# Altium schematic sheet Analog - Low Speed SE.SchDoc: Analog - Low Speed Single-Ended
size B; DrawnBy: Jasper Yun; SheetNumber: 11; SheetTotal: 13; Competition: SAC 2021; Subteam: Avionics; University: McGill University; Location: Montreal, Quebec; Project: Avionics Project Name; MRT: McGill Rocket Team
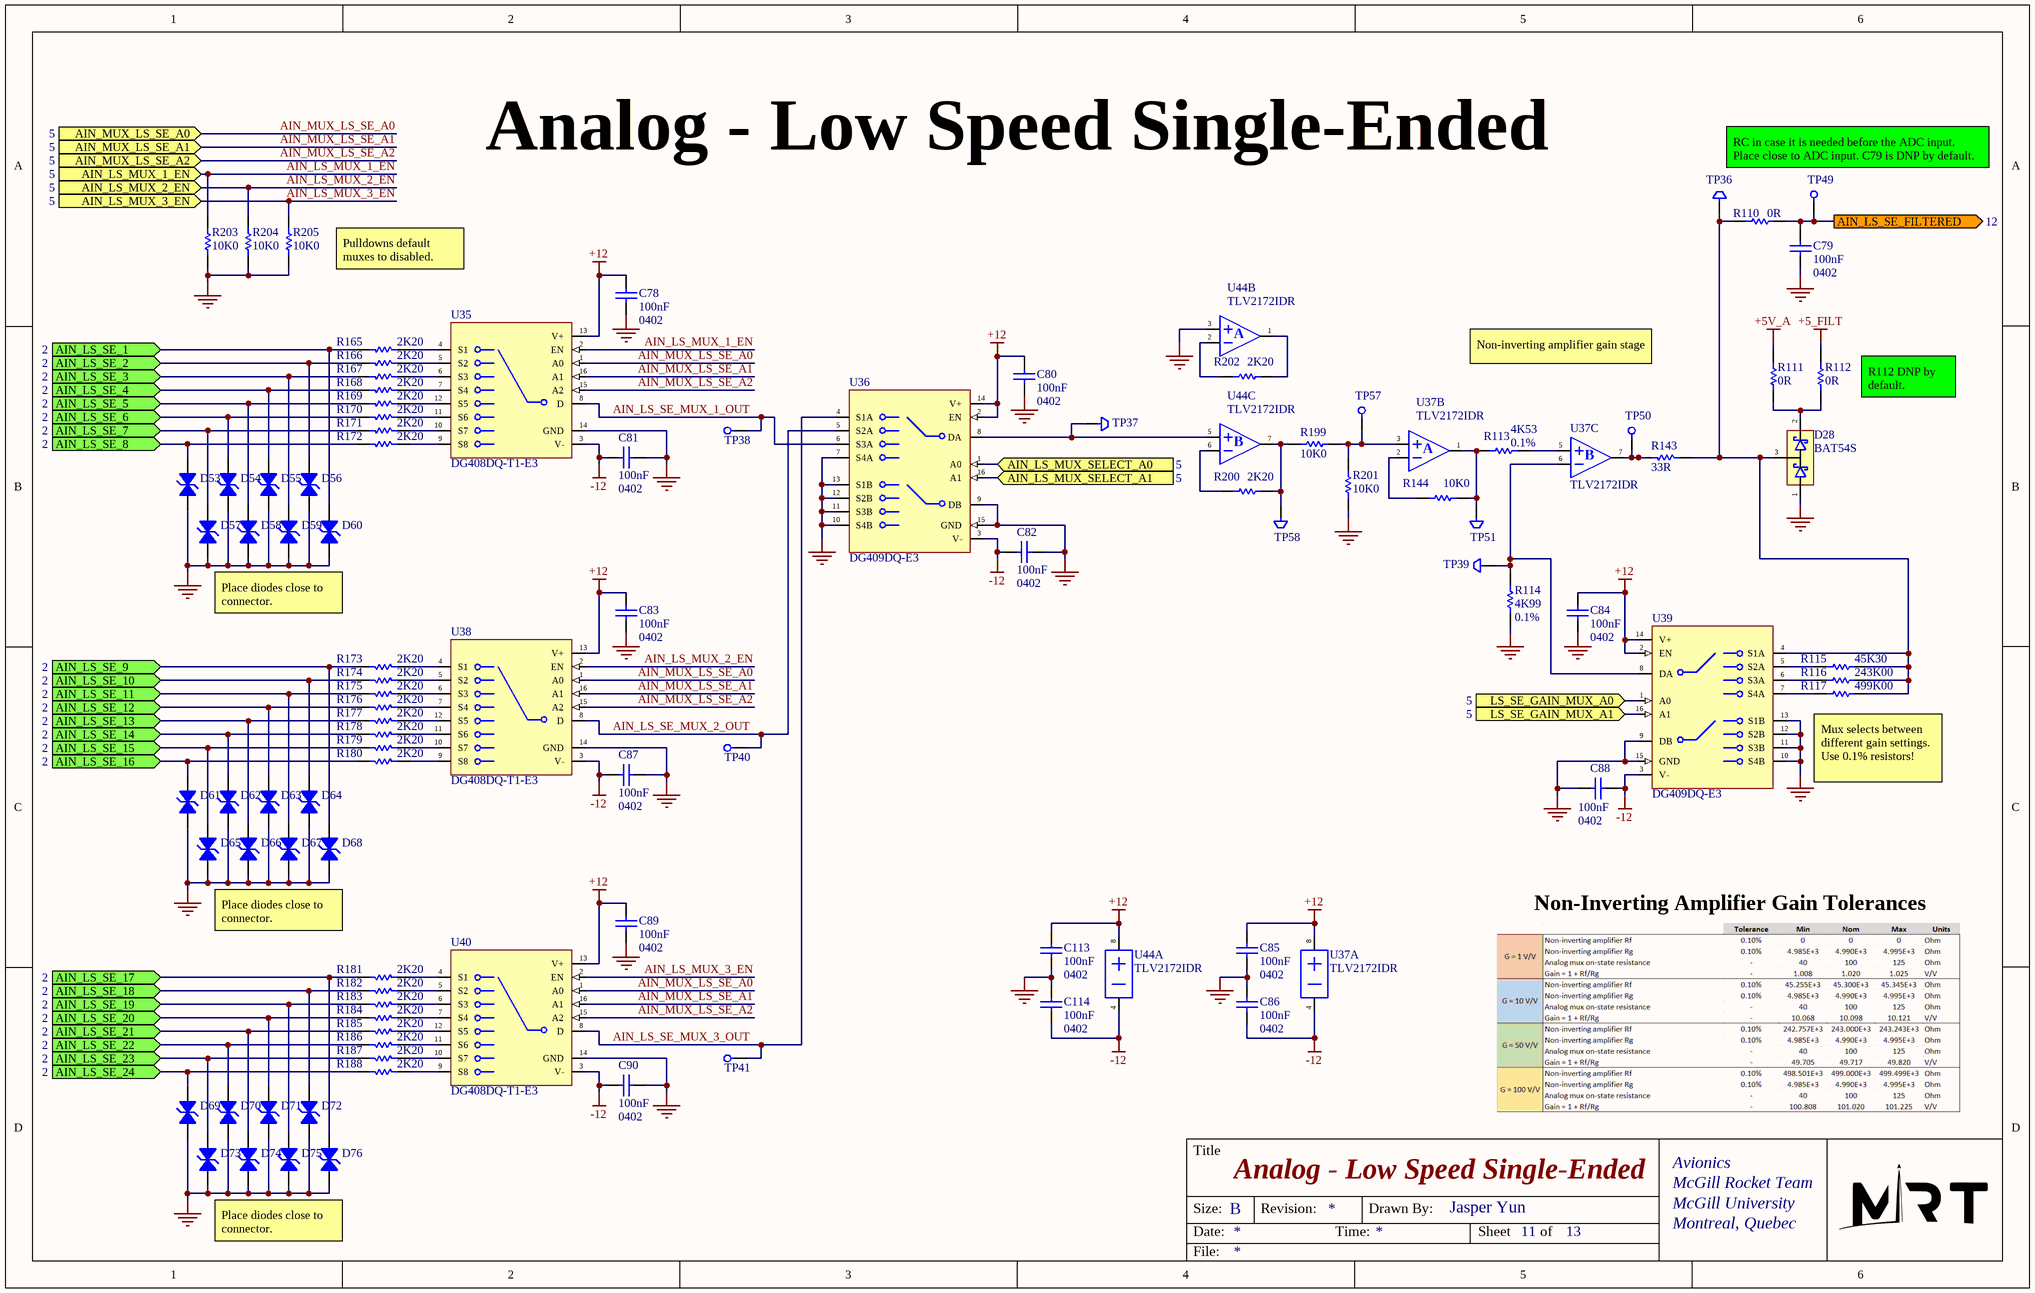
[diagram p0: Analog - Low Speed SE.SchDoc]

## Parts
C78  100nF  value 0402  [0402 CAP]
C79  100nF  value 0402  [0402 CAP]
C80  100nF  value 0402  [0402 CAP]
C81  100nF  value 0402  [0402 CAP]
C82  100nF  value 0402  [0402 CAP]
C83  100nF  value 0402  [0402 CAP]
C84  100nF  value 0402  [0402 CAP]
C85  100nF  value 0402  [0402 CAP]
C86  100nF  value 0402  [0402 CAP]
C87  100nF  value 0402  [0402 CAP]
C88  100nF  value 0402  [0402 CAP]
C89  100nF  value 0402  [0402 CAP]
C90  100nF  value 0402  [0402 CAP]
C113  100nF  value 0402  [0402 CAP]
C114  100nF  value 0402  [0402 CAP]
D28  BAT54S  [SOT23-3]
D53  D12V0L1B2LP-7B  [DFN1006-2]  (value not drawn)
D54  D12V0L1B2LP-7B  [DFN1006-2]  (value not drawn)
D55  D12V0L1B2LP-7B  [DFN1006-2]  (value not drawn)
D56  D12V0L1B2LP-7B  [DFN1006-2]  (value not drawn)
D57  D12V0L1B2LP-7B  [DFN1006-2]  (value not drawn)
D58  D12V0L1B2LP-7B  [DFN1006-2]  (value not drawn)
D59  D12V0L1B2LP-7B  [DFN1006-2]  (value not drawn)
D60  D12V0L1B2LP-7B  [DFN1006-2]  (value not drawn)
D61  D12V0L1B2LP-7B  [DFN1006-2]  (value not drawn)
D62  D12V0L1B2LP-7B  [DFN1006-2]  (value not drawn)
D63  D12V0L1B2LP-7B  [DFN1006-2]  (value not drawn)
D64  D12V0L1B2LP-7B  [DFN1006-2]  (value not drawn)
D65  D12V0L1B2LP-7B  [DFN1006-2]  (value not drawn)
D66  D12V0L1B2LP-7B  [DFN1006-2]  (value not drawn)
D67  D12V0L1B2LP-7B  [DFN1006-2]  (value not drawn)
D68  D12V0L1B2LP-7B  [DFN1006-2]  (value not drawn)
D69  D12V0L1B2LP-7B  [DFN1006-2]  (value not drawn)
D70  D12V0L1B2LP-7B  [DFN1006-2]  (value not drawn)
D71  D12V0L1B2LP-7B  [DFN1006-2]  (value not drawn)
D72  D12V0L1B2LP-7B  [DFN1006-2]  (value not drawn)
D73  D12V0L1B2LP-7B  [DFN1006-2]  (value not drawn)
D74  D12V0L1B2LP-7B  [DFN1006-2]  (value not drawn)
D75  D12V0L1B2LP-7B  [DFN1006-2]  (value not drawn)
D76  D12V0L1B2LP-7B  [DFN1006-2]  (value not drawn)
R110  0R  [0402 RES]
R111  0R  [0402 RES]
R112  0R  [0402 RES]
R113  4K53  value 0.1%  [0402 RES]
R114  4K99  value 0.1%  [0402 RES]
R115  45K30  [0402 RES]
R116  243K00  [0402 RES]
R117  499K00  [0402 RES]
R143  33R  [0402 RES]
R144  10K0  [0402 RES]
R165  2K20  [0402 RES]
R166  2K20  [0402 RES]
R167  2K20  [0402 RES]
R168  2K20  [0402 RES]
R169  2K20  [0402 RES]
R170  2K20  [0402 RES]
R171  2K20  [0402 RES]
R172  2K20  [0402 RES]
R173  2K20  [0402 RES]
R174  2K20  [0402 RES]
R175  2K20  [0402 RES]
R176  2K20  [0402 RES]
R177  2K20  [0402 RES]
R178  2K20  [0402 RES]
R179  2K20  [0402 RES]
R180  2K20  [0402 RES]
R181  2K20  [0402 RES]
R182  2K20  [0402 RES]
R183  2K20  [0402 RES]
R184  2K20  [0402 RES]
R185  2K20  [0402 RES]
R186  2K20  [0402 RES]
R187  2K20  [0402 RES]
R188  2K20  [0402 RES]
R199  10K0  [0402 RES]
R200  2K20  [0402 RES]
R201  10K0  [0402 RES]
R202  2K20  [0402 RES]
R203  10K0  [0402 RES]
R204  10K0  [0402 RES]
R205  10K0  [0402 RES]
TP36  Test Point - Keystone 5015  [Test Point Keystone 5015]  (value not drawn)
TP37  Test Point - Keystone 5015  [Test Point Keystone 5015]  (value not drawn)
TP38  Test Point - SMD Pad  [TEST POINT SMD PAD]  (value not drawn)  (no BOM)
TP39  Test Point - Keystone 5015  [Test Point Keystone 5015]  (value not drawn)
TP40  Test Point - SMD Pad  [TEST POINT SMD PAD]  (value not drawn)  (no BOM)
TP41  Test Point - SMD Pad  [TEST POINT SMD PAD]  (value not drawn)  (no BOM)
TP49  Test Point - SMD Pad  [TEST POINT SMD PAD]  (value not drawn)  (no BOM)
TP50  Test Point - SMD Pad  [TEST POINT SMD PAD]  (value not drawn)  (no BOM)
TP51  Test Point - Keystone 5015  [Test Point Keystone 5015]  (value not drawn)
TP57  Test Point - SMD Pad  [TEST POINT SMD PAD]  (value not drawn)  (no BOM)
TP58  Test Point - Keystone 5015  [Test Point Keystone 5015]  (value not drawn)
U35  DG408DQ-T1-E3  [TSSOP-16]
U36  DG409DQ-E3  [TSSOP-16]
U37  TLV2172IDR  [SOIC-8]  (parts A,B,C of 3)
U38  DG408DQ-T1-E3  [TSSOP-16]
U39  DG409DQ-E3  [TSSOP-16]
U40  DG408DQ-T1-E3  [TSSOP-16]
U44  TLV2172IDR  [SOIC-8]  (parts A,B,C of 3)

## Ports
AIN_LS_MUX_1_EN (in, see 5), AIN_LS_MUX_2_EN (in, see 5), AIN_LS_MUX_3_EN (in, see 5), AIN_LS_MUX_SELECT_A0 (in, see 5), AIN_LS_MUX_SELECT_A1 (in, see 5), AIN_LS_SE_1 (in, see 2), AIN_LS_SE_2 (in, see 2), AIN_LS_SE_3 (in, see 2), AIN_LS_SE_4 (in, see 2), AIN_LS_SE_5 (in, see 2), AIN_LS_SE_6 (in, see 2), AIN_LS_SE_7 (in, see 2), AIN_LS_SE_8 (in, see 2), AIN_LS_SE_9 (in, see 2), AIN_LS_SE_10 (in, see 2), AIN_LS_SE_11 (in, see 2), AIN_LS_SE_12 (in, see 2), AIN_LS_SE_13 (in, see 2), AIN_LS_SE_14 (in, see 2), AIN_LS_SE_15 (in, see 2), AIN_LS_SE_16 (in, see 2), AIN_LS_SE_17 (in, see 2), AIN_LS_SE_18 (in, see 2), AIN_LS_SE_19 (in, see 2), AIN_LS_SE_20 (in, see 2), AIN_LS_SE_21 (in, see 2), AIN_LS_SE_22 (in, see 2), AIN_LS_SE_23 (in, see 2), AIN_LS_SE_24 (in, see 2), AIN_LS_SE_FILTERED (out, see 12), AIN_MUX_LS_SE_A0 (in, see 5), AIN_MUX_LS_SE_A1 (in, see 5), AIN_MUX_LS_SE_A2 (in, see 5), LS_SE_GAIN_MUX_A0 (in, see 5), LS_SE_GAIN_MUX_A1 (in, see 5)

## Nets
+5_FILT: R112.1
+5V_A: R111.1
+12: C78.2 C80.2 C83.2 C84.2 C85.2 C89.2 C113.2 U35.13(V+) U36.2(EN) U36.14(V+) U37.8(VCC+) U38.13(V+) U39.2(EN) U39.14(V+) U40.13(V+) U44.8(VCC+)
-12: C81.2 C82.2 C86.1 C87.2 C88.2 C90.2 C114.1 U35.3(V-) U36.3(V-) U37.4(VCC-) U38.3(V-) U39.3(V-) U40.3(V-) U44.4(VCC-)
GND: C78.1 C79.1 C80.1 C81.1 C82.1 C83.1 C84.1 C85.1 C86.2 C87.1 C88.1 C89.1 C90.1 C113.1 C114.2 D28.1 D53.1 D54.1 D55.1 D56.1 D57.1 D58.1 D59.1 D60.1 D61.1 D62.1 D63.1 D64.1 D65.1 D66.1 D67.1 D68.1 D69.1 D70.1 D71.1 D72.1 D73.1 D74.1 D75.1 D76.1 R114.1 R201.1 R203.2 R204.2 R205.2 U35.14(GND) U36.7(S4A) U36.9(DB) U36.10(S4B) U36.11(S3B) U36.12(S2B) U36.13(S1B) U36.15(GND) U38.14(GND) U39.9(DB) U39.10(S4B) U39.11(S3B) U39.12(S2B) U39.13(S1B) U39.15(GND) U40.14(GND) U44.3
AIN_LS_MUX_1_EN: R203.1 U35.2(EN) ; port AIN_LS_MUX_1_EN
AIN_LS_MUX_2_EN: R204.1 U38.2(EN) ; port AIN_LS_MUX_2_EN
AIN_LS_MUX_3_EN: R205.1 U40.2(EN) ; port AIN_LS_MUX_3_EN
AIN_LS_MUX_SELECT_A0: U36.1(A0) ; port AIN_LS_MUX_SELECT_A0
AIN_LS_MUX_SELECT_A1: U36.16(A1) ; port AIN_LS_MUX_SELECT_A1
AIN_LS_SE_1: D60.2 R165.1 ; port AIN_LS_SE_1
AIN_LS_SE_2: D56.2 R166.1 ; port AIN_LS_SE_2
AIN_LS_SE_3: D59.2 R167.1 ; port AIN_LS_SE_3
AIN_LS_SE_4: D55.2 R168.1 ; port AIN_LS_SE_4
AIN_LS_SE_5: D58.2 R169.1 ; port AIN_LS_SE_5
AIN_LS_SE_6: D54.2 R170.1 ; port AIN_LS_SE_6
AIN_LS_SE_7: D57.2 R171.1 ; port AIN_LS_SE_7
AIN_LS_SE_8: D53.2 R172.1 ; port AIN_LS_SE_8
AIN_LS_SE_9: D68.2 R173.1 ; port AIN_LS_SE_9
AIN_LS_SE_10: D64.2 R174.1 ; port AIN_LS_SE_10
AIN_LS_SE_11: D67.2 R175.1 ; port AIN_LS_SE_11
AIN_LS_SE_12: D63.2 R176.1 ; port AIN_LS_SE_12
AIN_LS_SE_13: D66.2 R177.1 ; port AIN_LS_SE_13
AIN_LS_SE_14: D62.2 R178.1 ; port AIN_LS_SE_14
AIN_LS_SE_15: D65.2 R179.1 ; port AIN_LS_SE_15
AIN_LS_SE_16: D61.2 R180.1 ; port AIN_LS_SE_16
AIN_LS_SE_17: D76.2 R181.1 ; port AIN_LS_SE_17
AIN_LS_SE_18: D72.2 R182.1 ; port AIN_LS_SE_18
AIN_LS_SE_19: D75.2 R183.1 ; port AIN_LS_SE_19
AIN_LS_SE_20: D71.2 R184.1 ; port AIN_LS_SE_20
AIN_LS_SE_21: D74.2 R185.1 ; port AIN_LS_SE_21
AIN_LS_SE_22: D70.2 R186.1 ; port AIN_LS_SE_22
AIN_LS_SE_23: D73.2 R187.1 ; port AIN_LS_SE_23
AIN_LS_SE_24: D69.2 R188.1 ; port AIN_LS_SE_24
AIN_LS_SE_FILTERED: C79.2 R110.1 TP49.1 ; port AIN_LS_SE_FILTERED
AIN_LS_SE_MUX_1_OUT: TP38.1 U35.8(D) U36.6(S3A)
AIN_LS_SE_MUX_2_OUT: TP40.1 U36.5(S2A) U38.8(D)
AIN_LS_SE_MUX_3_OUT: TP41.1 U36.4(S1A) U40.8(D)
AIN_MUX_LS_SE_A0: U35.1(A0) U38.1(A0) U40.1(A0) ; port AIN_MUX_LS_SE_A0
AIN_MUX_LS_SE_A1: U35.16(A1) U38.16(A1) U40.16(A1) ; port AIN_MUX_LS_SE_A1
AIN_MUX_LS_SE_A2: U35.15(A2) U38.15(A2) U40.15(A2) ; port AIN_MUX_LS_SE_A2
LS_SE_GAIN_MUX_A0: U39.1(A0) ; port LS_SE_GAIN_MUX_A0
LS_SE_GAIN_MUX_A1: U39.16(A1) ; port LS_SE_GAIN_MUX_A1
NetD28_2: D28.2 R111.2 R112.2
NetD28_3: D28.3 R110.2 R115.1 R116.1 R117.1 R143.2 TP36.1 U39.4(S1A)
NetR113_1: R113.1 U37.5
NetR113_2: R113.2 R144.1 TP51.1 U37.1
NetR114_2: R114.2 TP39.1 U37.6 U39.8(DA)
NetR115_2: R115.2 U39.5(S2A)
NetR116_2: R116.2 U39.6(S3A)
NetR117_2: R117.2 U39.7(S4A)
NetR143_1: R143.1 TP50.1 U37.7
NetR144_2: R144.2 U37.2
NetR165_2: R165.2 U35.4(S1)
NetR166_2: R166.2 U35.5(S2)
NetR167_2: R167.2 U35.6(S3)
NetR168_2: R168.2 U35.7(S4)
NetR169_2: R169.2 U35.12(S5)
NetR170_2: R170.2 U35.11(S6)
NetR171_2: R171.2 U35.10(S7)
NetR172_2: R172.2 U35.9(S8)
NetR173_2: R173.2 U38.4(S1)
NetR174_2: R174.2 U38.5(S2)
NetR175_2: R175.2 U38.6(S3)
NetR176_2: R176.2 U38.7(S4)
NetR177_2: R177.2 U38.12(S5)
NetR178_2: R178.2 U38.11(S6)
NetR179_2: R179.2 U38.10(S7)
NetR180_2: R180.2 U38.9(S8)
NetR181_2: R181.2 U40.4(S1)
NetR182_2: R182.2 U40.5(S2)
NetR183_2: R183.2 U40.6(S3)
NetR184_2: R184.2 U40.7(S4)
NetR185_2: R185.2 U40.12(S5)
NetR186_2: R186.2 U40.11(S6)
NetR187_2: R187.2 U40.10(S7)
NetR188_2: R188.2 U40.9(S8)
NetR199_1: R199.1 R201.2 TP57.1 U37.3
NetR199_2: R199.2 R200.1 TP58.1 U44.7
NetR200_2: R200.2 U44.6
NetR202_1: R202.1 U44.1
NetR202_2: R202.2 U44.2
NetTP37_1: TP37.1 U36.8(DA) U44.5

## Notes on the sheet
- RC in case it is needed before the ADC input. Place close to ADC input. C79 is DNP by default.
- Pulldowns default muxes to disabled.
- Non-inverting amplifier gain stage
- (near R112) R112 DNP by default.
- Place diodes close to connector.
- Mux selects between different gain settings.
  Use 0.1% resistors!
- Non-Inverting Amplifier Gain Tolerances
- Title
- Size:
- Date:
- B
- Revision:
- Time:
- Drawn By:
- Sheet
- of
- File:
- (in symbol OP AMP RC4580, part B) A
- (in symbol OP AMP RC4580, part C) B

## Library data of the parts
C78-C90 C113 C114 = Cap: Capacitor; Published: 8-Jun-2000; LatestRevisionDate: 17-Jul-2002; LatestRevisionNote: Re-released for DXP Platform.; PackageReference: RAD-0.3; Publisher: Altium Limited; PackageDescription: Radial Cap, Thru-Hole; 2 Leads; 0.3 in Pin Spacing
D28 = Schottky Diode Array BAT54S: Rectifier Diode Small Signal Schottky 40V 0.3A 5ns 3-Pin SOT-23 T/R; Manufacturer: STMicroelectronics; Manufacturer Part Number: BAT54SFILM; Forward Current: 300mA; Peak Non-Repetitive Surge Current: 1A; Forward Voltage: 900mV; Max Reverse Current: 100uA; Max Reverse Leakage Current: 1uA; Element Configuration: Single; Voltage Rating (DC): 30V; Supplier 1: Digi-Key; RoHS: Yes; Category: Rectifier Diodes; Stock 1: 2760; Pricing 1: 1=0.34000, 10=0.27800, 100=0.14730, 500=0.09694, 1000=0.06592 (USD); Mount: Surface Mount; Case/Package: SOT-23; Number of Pins: 3; Weight: 0.1lb; Min Operating Temperature: -40°C; Max Operating Temperature: 150°C; Reverse Recovery Time: 5ns; Max Repetitive Reverse Voltage (Vrrm): 40V; Packaging: Tape and Reel; Package Quantity: 3000; Average Rectified Current: 300mA; Max Forward Surge Current (Ifsm): 1A; Max Reverse Voltage (DC): 40V; Max Surge Current: 1A; Recovery Time: 5ns; Termination: SMD/SMT; Current Rating: 300mA; Length: 2.9mm; Width: 3.05mm; Height: 0.95mm; Radiation Hardening: No; REACH SVHC: No SVHC; RoHS Compliant: Yes; Lead Free: Lead Free; ComponentLink1URL: https://datasheet.ciiva.com/1200/1689724-1200683.pdf?src-supplier=Farnell; ComponentLink1Description: https://datasheet.ciiva.com/1200/1689724-1200683.pdf?src-supplier=Farnell; ComponentLink2URL: https://datasheet.ciiva.com/1177/1689724-1177974.pdf?src-supplier=Element14; ComponentLink2Description: https://datasheet.ciiva.com/1177/1689724-1177974.pdf?src-supplier=Element14; ComponentLink3URL: https://datasheet.ciiva.com/1200/cd00001322-1200682.pdf?src-supplier=Farnell; ComponentLink3Description: https://datasheet.ciiva.com/1200/cd00001322-1200682.pdf?src-supplier=Farnell; ComponentLink4URL: https://datasheet.ciiva.com/14168/cd00001322-14168028.pdf?src-supplier=Distrelec; ComponentLink4Description: https://datasheet.ciiva.com/14168/cd00001322-14168028.pdf?src-supplier=Distrelec; ComponentLink5URL: https://datasheet.ciiva.com/905/cd00001322-905882.pdf?src-supplier=Digi-Key; ComponentLink5Description: https://datasheet.ciiva.com/905/cd00001322-905882.pdf?src-supplier=Digi-Key; ComponentLink6URL: https://datasheet.ciiva.com/905/cd00001322-905881.pdf?src-supplier=Digi-Key; ComponentLink6Description: https://datasheet.ciiva.com/905/cd00001322-905881.pdf?src-supplier=Digi-Key; ComponentLink7URL: https://datasheet.ciiva.com/905/cd00001322-905883.pdf?src-supplier=Digi-Key; ComponentLink7Description: https://datasheet.ciiva.com/905/cd00001322-905883.pdf?src-supplier=Digi-Key; ComponentLink8URL: https://datasheet.ciiva.com/1177/1689724-1177973.pdf?src-supplier=Element14; ComponentLink8Description: https://datasheet.ciiva.com/1177/1689724-1177973.pdf?src-supplier=Element14; Supplier Part Number 1: 497-2522-1-ND
D53-D76 = Diode Zener Bidirectional: Bidirectional Zener diode
R110-R112 R115-R117 R143 R144 R165-R188 R199-R205 = Res1: Resistor; Value: 1%; Published: 8-Jun-2000; LatestRevisionDate: 17-Jul-2002; LatestRevisionNote: Re-released for DXP Platform.; PackageReference: AXIAL-0.3; Publisher: Altium Limited; PackageDescription: Axial Device, Thru-Hole; 2 Leads; 0.3 in Pin Spacing
R113 R114 = Res1: Resistor; Published: 8-Jun-2000; LatestRevisionDate: 17-Jul-2002; LatestRevisionNote: Re-released for DXP Platform.; PackageReference: AXIAL-0.3; Publisher: Altium Limited; PackageDescription: Axial Device, Thru-Hole; 2 Leads; 0.3 in Pin Spacing
TP36 TP37 TP39 TP51 TP58 = Test Point - Keystone 5015: Keystone 5015 Test point
TP38 TP40 TP41 TP49 TP50 TP57 = Test Point - SMD Pad: SMD Pad test point
U35 U38 U40 = Analog Mux DG408DQ-T1-E3: DG408DQ-T1-E3; Multiplexer Single 8: 1; 15 V; 18 V; 24 V; 28 V; 16-Pin TSSOP; Manufacturer: Vishay Siliconix; Min Supply Voltage: 13V; Max Supply Voltage: 44V; Number of Inputs: 8; Number of Outputs: 1; Operating Supply Voltage: 36V; Propagation Delay: 160ns; Max Power Dissipation: 600mW; Min Dual Supply Voltage: 5V; Max Dual Supply Voltage: 20V; Dual Supply Voltage: 15V; On-State Resistance: 90R; Turn-On Delay Time: 150ns; Max Supply Current: 500uA; Operating Supply Current: 1uA; Supply Type: Single,Dual; Nominal Supply Current: 10uA; High Level Output Current: 30mA; Supplier 1: RSComponents; Manufacturer Part Number: DG408DQ-T1-E3; RoHS: Yes; Category: Decoders and Multiplexers; Stock 1: 2985; Pricing 1: 5=2.69000, 50=2.02000, 250=1.57000 (GBP); Mount: Surface Mount; Case/Package: TSSOP; Number of Pins: 16; Weight: 0.006102oz; Contact Plating: Tin,Matte; Min Operating Temperature: -40°C; Max Operating Temperature: 85°C; Packaging: Tape and Reel; Number of Channels: 8; Package Quantity: 1; Turn-Off Delay Time: 150ns; Logic Function: Multiplexer; Power Dissipation: 600mW; Number of Circuits: 1; Series: -; Supply Current: 10uA; Length: 5.07mm; Width: 4.4mm; Height: 0.92mm; Radiation Hardening: No; Reach SVHC Compliant: Unknown; Lead Free: Lead Free; RoHS Compliant: Yes; ComponentLink1URL: https://datasheet.ciiva.com/15127/getdatasheetpartid-99309-15127097.pdf?src-supplier=Verical; ComponentLink1Description: https://datasheet.ciiva.com/15127/getdatasheetpartid-99309-15127097.pdf?src-supplier=Verical; ComponentLink2URL: https://datasheet.ciiva.com/11499/dg408-11499135.pdf?src-supplier=Avnet; ComponentLink2Description: https://datasheet.ciiva.com/11499/dg408-11499135.pdf?src-supplier=Avnet; ComponentLink3URL: https://datasheet.ciiva.com/1666/dg408-1666717.pdf?src-supplier=Digi-Key; ComponentLink3Description: https://datasheet.ciiva.com/1666/dg408-1666717.pdf?src-supplier=Digi-Key; ComponentLink4URL: https://datasheet.ciiva.com/1666/dg408-1666718.pdf?src-supplier=Digi-Key; ComponentLink4Description: https://datasheet.ciiva.com/1666/dg408-1666718.pdf?src-supplier=Digi-Key; ComponentLink5URL: https://datasheet.ciiva.com/1666/dg408-1666719.pdf?src-supplier=Digi-Key; ComponentLink5Description: https://datasheet.ciiva.com/1666/dg408-1666719.pdf?src-supplier=Digi-Key; Supplier Part Number 1: 2509481281
U36 U39 = Analog Mux DG409DQ-E3: DG409 Series 20 V 8-Ch/Dual 4-Ch High-Performance CMOS Analog Multiplexer; Manufacturer: Vishay Siliconix; Min Supply Voltage: 13V; Max Supply Voltage: 44V; Number of Inputs: 8; Number of Outputs: 2; Number of Channels: 4; Min Dual Supply Voltage: 5V; Max Dual Supply Voltage: 20V; Propagation Delay: 160ns; On-State Resistance: 90R; Operating Supply Current: 1uA; Turn-On Delay Time: 150ns; Max Power Dissipation: 600mW; Max Supply Current: 500uA; Supply Type: Dual,Single; Dual Supply Voltage: 15V; Operating Supply Voltage: 36V; Supplier 1: Mouser; Manufacturer Part Number: DG409DQ-E3; RoHS: Yes; Category: Decoders and Multiplexers; Stock 1: 4584; Pricing 1: 1=4.36000, 10=3.91000, 50=3.70000, 100=3.20000, 1000=2.73000, 10000=2.40000 (USD); Mount: Surface Mount; Case/Package: TSSOP; Number of Pins: 16; Weight: 0.006102oz; Min Operating Temperature: -40°C; Max Operating Temperature: 85°C; Package Quantity: 360; Packaging: Rail/Tube; Logic Function: Multiplexer; Turn-Off Delay Time: 150ns; Power Dissipation: 600mW; Series: -; Length: 5.07mm; Width: 4.4mm; Height: 0.92mm; Radiation Hardening: No; Lead Free: Lead Free; RoHS Compliant: Yes; ComponentLink1URL: https://datasheet.ciiva.com/1677/dg408-1677556.pdf?src-supplier=Digi-Key; ComponentLink1Description: https://datasheet.ciiva.com/1677/dg408-1677556.pdf?src-supplier=Digi-Key; ComponentLink2URL: https://datasheet.ciiva.com/2978/dg408-2978747.pdf?src-supplier=Avnet; ComponentLink2Description: https://datasheet.ciiva.com/2978/dg408-2978747.pdf?src-supplier=Avnet; Supplier Part Number 1: 78-DG409DQ-E3
U37 U44 = OP AMP RC4580: 2-channel, 12-MHz, low-noise, low-distortion audio op amp with high output current 8-SOIC -40 to 85; Manufacturer: Texas Instruments; Manufacturer Part Number: RC4580IDR; Min Supply Voltage: 4V; Max Supply Voltage: 32V; Max Dual Supply Voltage: 16V; Min Dual Supply Voltage: 2V; Voltage Gain: 110dB; Common Mode Rejection Ratio: 80dB; Nominal Gain Bandwidth Product: 12MHz; Number of Channels: 2; Slew Rate: 5V/µs; Max I/O Voltage: 3mV; Input Bias Current: 500nA; Operating Supply Current: 6mA; Output Current per Channel: 50mA; Nominal Supply Current: 4.5mA; Dual Supply Voltage: 9V; Load Impedance: 2kR; Supplier 1: Digi-Key; RoHS: Yes; Category: Amplifiers - Op Amps, Buffer, Instrumentation; Stock 1: 3503; Pricing 1: 1=0.46000, 10=0.37400, 25=0.34200, 100=0.25460, 250=0.23072, 500=0.19092, 1000=0.14320 (USD); Case/Package: D; Number of Pins: 8; Weight: 0.002561oz; Contact Plating: Gold; Min Operating Temperature: -40°C; Max Operating Temperature: 85°C; Packaging: Tape and Reel; Package Quantity: 1; Number of Circuits: 2; Gain Bandwidth Product: 12MHz; Input Offset Voltage (Vos): 3mV; Series: -; Supply Current: 4.5mA; Bandwidth: 12MHz; Unity Gain Bandwidth Product: 12MHz; Number of Elements: 2; Technology: BIPOLAR; Radiation Hardening: No; Lead Free: Lead Free; RoHS Compliant: Yes; Reach SVHC Compliant: No SVHC; ComponentLink1URL: https://datasheet.ciiva.com/23806/1716592-23806563.pdf?src-supplier=Newark; ComponentLink1Description: https://datasheet.ciiva.com/23806/1716592-23806563.pdf?src-supplier=Newark; ComponentLink2URL: https://datasheet.ciiva.com/22654/1882301-22654837.pdf?src-supplier=Element14; ComponentLink2Description: https://datasheet.ciiva.com/22654/1882301-22654837.pdf?src-supplier=Element14; ComponentLink3URL: https://datasheet.ciiva.com/46382/1840282-46382300.pdf?src-supplier=Element14; ComponentLink3Description: https://datasheet.ciiva.com/46382/1840282-46382300.pdf?src-supplier=Element14; ComponentLink4URL: https://datasheet.ciiva.com/1796/rc4580-1796261.pdf?src-supplier=Digi-Key; ComponentLink4Description: https://datasheet.ciiva.com/1796/rc4580-1796261.pdf?src-supplier=Digi-Key; ComponentLink5URL: https://datasheet.ciiva.com/1796/rc4580-1796260.pdf?src-supplier=Digi-Key; ComponentLink5Description: https://datasheet.ciiva.com/1796/rc4580-1796260.pdf?src-supplier=Digi-Key; ComponentLink6URL: https://datasheet.ciiva.com/1796/rc4580-1796262.pdf?src-supplier=Digi-Key; ComponentLink6Description: https://datasheet.ciiva.com/1796/rc4580-1796262.pdf?src-supplier=Digi-Key; Supplier Part Number 1: 296-15367-1-ND